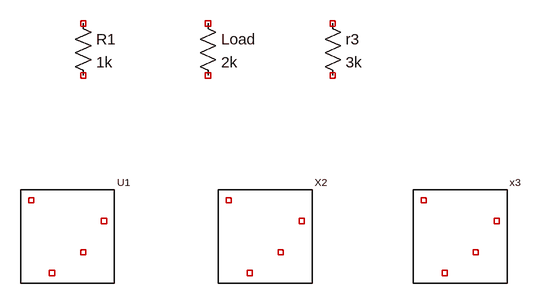
[diagram p0: schematic instance_names.asc]
instance_names.asc, the LTspice schematic file:
Version 4
SHEET 1 880 680
SYMBOL res 96 144 R0
SYMATTR InstName R1
SYMATTR Value 1k
SYMBOL res 288 144 R0
SYMATTR InstName Load
SYMATTR Value 2k
SYMBOL res 480 144 R0
SYMATTR InstName r3
SYMATTR Value 3k
SYMBOL cell4 96 480 R0
SYMATTR InstName U1
SYMBOL cell4 400 480 R0
SYMATTR InstName X2
SYMBOL cell4 700 480 R0
SYMATTR InstName x3

The netlist it stands for:
* instance_names.asc
R1 NC_01 NC_02 1k
R§Load NC_03 NC_04 2k
r3 NC_05 NC_06 3k
XU1 NC_07 NC_08 NC_09 NC_10 cell4  ; pins a b c d
XX2 NC_11 NC_12 NC_13 NC_14 cell4  ; pins a b c d
Xx3 NC_15 NC_16 NC_17 NC_18 cell4  ; pins a b c d
.backanno
.end